# EAGLE design mssaPIC12 (EAGLE 9.6.2)
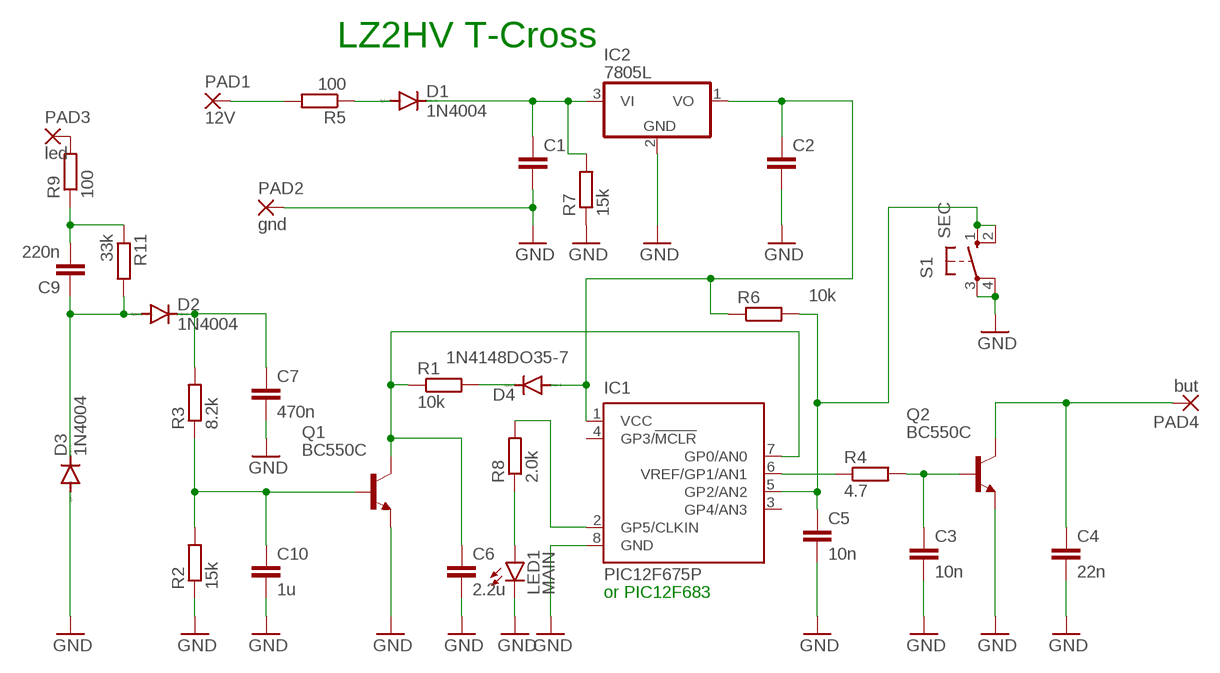
[diagram p0: schematic, sheet 1]

## Parts
C1  100n  C5/2.5  [C5B2.5]
C2  101n  C5/2.5  [C5B2.5]
C3  10n  C5/2.5  [C5B2.5]
C4  22n  C5/2.5  [C5B2.5]
C5  10n  C5/2.5  [C5B2.5]
C6  2.2u  C5/2.5  [C5B2.5]
C7  470n  C5/2.5  [C5B2.5]
C9  220n  C5/2.5  [C5B2.5]
C10  1u  C5/2.5  [C5B2.5]
D1  1N4004  [DO41-10]
D2  1N4004  [DO41-10]
D3  1N4004  [DO41-10]
D4  1N4148DO35-7  [DO35-7]
IC1  PIC12F675P  [DIL8]
IC2  7805L  [TO92]
LED1  MAIN  LED3MM  [LED3MM]
PAD1  12V  2,54/1,0  [2,54/1,0]
PAD2  gnd  2,54/1,0  [2,54/1,0]
PAD3  led  2,54/1,0  [2,54/1,0]
PAD4  but  2,54/1,0  [2,54/1,0]
Q1  BC550C  [TO92-EBC]
Q2  BC550C  [TO92-EBC]
R1  10k  R-EU_0207/7  [0207/7]
R2  15k  R-EU_0207/7  [0207/7]
R3  8.2k  R-EU_0207/7  [0207/7]
R4  4.7  R-EU_0207/7  [0207/7]
R5  100  R-EU_0207/7  [0207/7]
R6  10k  R-EU_0207/7  [0207/7]
R7  15k  R-EU_0207/7  [0207/7]
R8  2.0k  R-EU_0207/7  [0207/7]
R9  100  R-EU_0207/2V  [0207/2V]
R11  33k  R-EU_0207/2V  [0207/2V]
S1  SEC  10-XX  [B3F-10XX]

## Nets
GND: C1.2 C2.2 C3.2 C4.2 C5.2 C6.2 C7.2 C10.2 D3.A IC1.8(GND) IC2.2(GND) LED1.K(C) PAD2.1(P) Q1.E Q2.E R2.1 R7.1 S1.3(P) S1.4(P1)
N$1: C1.1 D1.C IC2.3(VI) R7.2
N$2: C2.1 D4.A IC1.1(VCC) IC2.1(VO) R6.1
N$3: C10.1 Q1.B R2.2 R3.1
N$4: C7.1 D2.C R3.2
N$5: PAD1.1(P) R5.2
N$6: IC1.6(VREF/GP1/AN1) R4.1
N$7: C3.1 Q2.B R4.2
N$8: C4.1 PAD4.1(P) Q2.C
N$9: C9.2 R9.1 R11.1
N$10: D1.A R5.1
N$11: D4.C R1.2
N$12: C5.1 IC1.5(GP2/AN2) R6.2 S1.1(S) S1.2(S1)
N$13: C9.1 D2.A D3.C R11.2
N$14: IC1.2(GP5/CLKIN) R8.2
N$15: LED1.A R8.1
N$16: PAD3.1(P) R9.2
N$17: C6.1 IC1.7(GP0/AN0) Q1.C R1.1
Unconnected: IC1.3(GP4/AN3) IC1.4(GP3/!MCLR)

## Notes on the sheet
- LZ2HV T-Cross
- or PIC12F683

## Library data of the parts
C1-C7 C9 C10 = capacitor-wima:C: CAPACITOR naming: grid - package width
D1-D3 = diode:1N4004: DIODE general purpose rectifier, 1 A
D4 = diode:1N4148: DIODE high speed (Philips)
IC1 = microchip:PIC12F675: 8-Pin FLASH-Based 8-Bit CMOS Microcontroller Precision Internal 4 MHz oscillator factory calibrated to ±1% Low Power Features: Standby Current: - 1 nA @ 2.0V, typical Operating Current: - 8.5µA @ 32 kHz, 2.0V, typical - 100µA @ 1 MHz, 2.0V, typical Watchdog Timer Current: - 300 nA @ 2.0V, typical Timer1 oscillator current: - 4µA @ 32 kHz, 2.0V, typical Analog-to-Digital Converter module: - 10-bit resolution - Programmable 4-channel input - Voltage reference input Source: http://www.microchip.com .. 41190E.pdf; MF: MICROCHIP; MPN: PIC12F675-E/P; OC_FARNELL: 9759018; OC_NEWARK: 92C4340
IC2 = linear:78*: Positive VOLTAGE REGULATOR Source: http://cache.national.com/ds/LM/LM78L05.pdf http://www.fairchildsemi.com/ds/LM/LM7805.pdf
LED1 = led:LED: LED OSRAM: - CHIPLED LG R971, LG N971, LY N971, LG Q971, LY Q971, LO R971, LY R971 LH N974, LH R974 LS Q976, LO Q976, LY Q976 LO Q996 - Hyper CHIPLED LW Q18S LB Q993, LB Q99A, LB R99A - SideLED LS A670, LO A670, LY A670, LG A670, LP A670 LB A673, LV A673, LT A673, LW A673 LH A674 LY A675 LS A676, LA A676, LO A676, LY A676, LW A676 LS A679, LY A679, LG A679 - Hyper Micro SIDELED® LS Y876, LA Y876, LO Y876, LY Y876 LT Y87S - SmartLED LW L88C, LW L88S LB L89C, LB L89S, LG L890 LS L89K, LO L89K, LY L89K LS L896, LA L896, LO L896, LY L896 - TOPLED LS T670, LO T670, LY T670, LG T670, LP T670 LSG T670, LSP T670, LSY T670, LOP T670, LYG T670 LG T671, LOG T671, LSG T671 LB T673, LV T673, LT T673, LW T673 LH T674 LS T676, LA T676, LO T676, LY T676, LB T676, LH T676, LSB T676, LW T676 LB T67C, LV T67C, LT T67C, LS T67K, LO T67K, LY T67K, LW E67C LS E67B, LA E67B, LO E67B, LY E67B, LB E67C, LV E67C, LT E67C LW T67C LS T679, LY T679, LG T679 LS T770, LO T770, LY T770, LG T770, LP T770 LB T773, LV T773, LT T773, LW T773 LH T774 LS E675, LA E675, LY E675, LS T675 LS T776, LA T776, LO T776, LY T776, LB T776 LHGB T686 LT T68C, LB T68C - Hyper Mini TOPLED® LB M676 - Mini TOPLED Santana® LG M470 LS M47K, LO M47K, LY M47K Source: http://www.osram.convergy.de LUXEON: - LUMILED® LXK2-PW12-R00, LXK2-PW12-S00, LXK2-PW14-U00, LXK2-PW14-V00 LXK2-PM12-R00, LXK2-PM12-S00, LXK2-PM14-U00 LXK2-PE12-Q00, LXK2-PE12-R00, LXK2-PE12-S00, LXK2-PE14-T00, LXK2-PE14-U00 LXK2-PB12-K00, LXK2-PB12-L00, LXK2-PB12-M00, LXK2-PB14-N00, LXK2-PB14-P00, LXK2-PB14-Q00 LXK2-PR12-L00, LXK2-PR12-M00, LXK2-PR14-Q00, LXK2-PR14-R00 LXK2-PD12-Q00, LXK2-PD12-R00, LXK2-PD12-S00 LXK2-PH12-R00, LXK2-PH12-S00 LXK2-PL12-P00, LXK2-PL12-Q00, LXK2-PL12-R00 Source: www.luxeon.com KINGBRIGHT: KA-3528ASYC Source: www.kingbright.com
PAD1-PAD4 = wirepad:2,54/1,0: THROUGH-HOLE PAD
Q1 Q2 = transistor-npn:BC550*: NPN Transistor
R1-R9 R11 = rcl:R-EU_: RESISTOR, European symbol; SPICEPREFIX: R
S1 = switch-omron:10-XX: OMRON SWITCH; MPN: B3F-1000; OC_FARNELL: 176432; OC_NEWARK: 36M3542

## Board
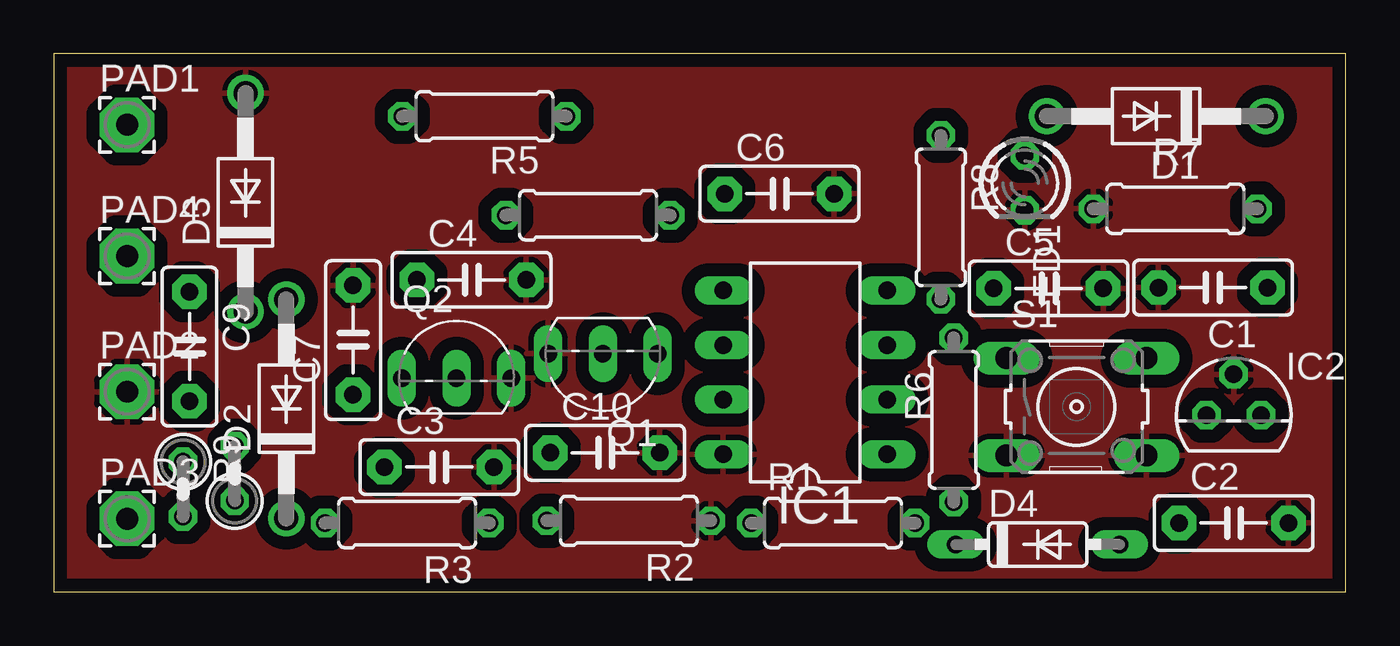
[diagram p1: board, top side]
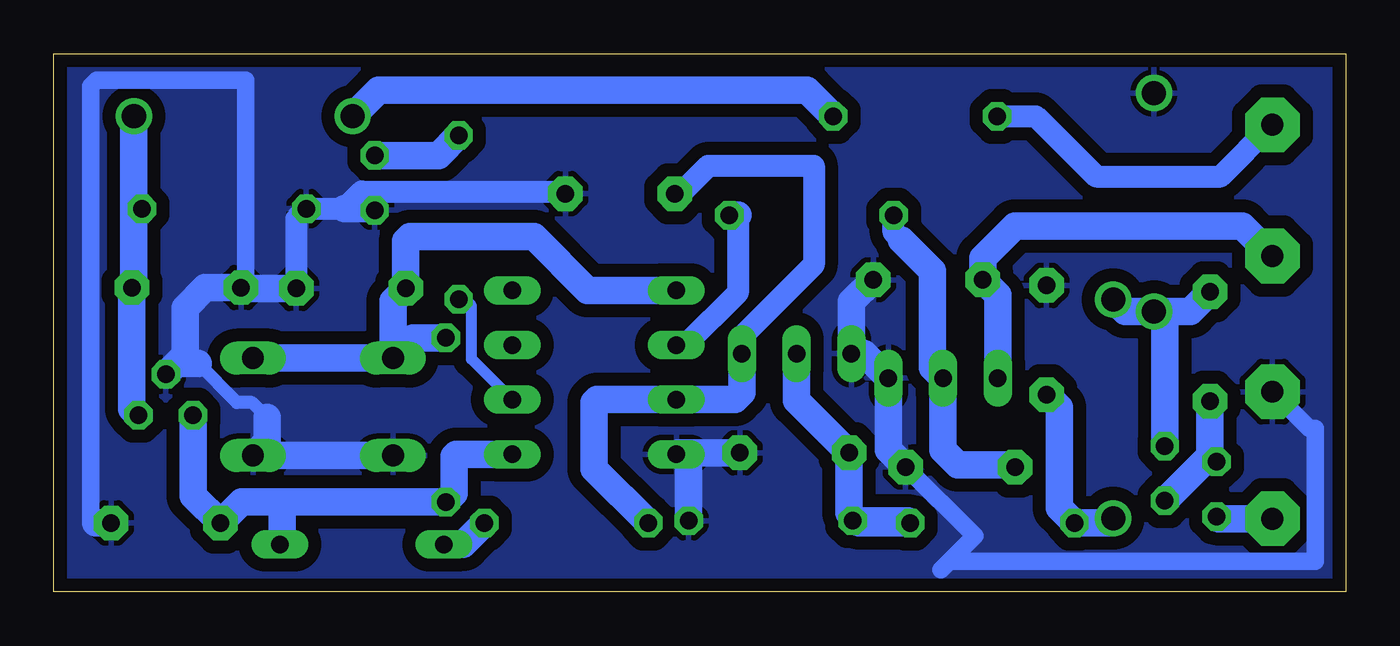
[diagram p2: board, bottom side, seen from below]

Size 60 x 25 mm. Coordinates in mm from the lower left corner, seen from the top.
Outline: 0,0 60,0 60,25 0,25 0,0
Copper layers (1*16): Top 0.035mm / dielectric 1.5mm / Bottom 0.035mm
Design rules "default *": minimum track width 10mil, minimum drill 24mil, track to track 8mil, track to pad 8mil, pad to pad 8mil, via to via 8mil, smd to smd 8mil, copper to edge 10mil, drill to drill 6mil, minimum pad ring 10mil, minimum via ring 8mil, stop-mask expansion 4mil, vias tented up to drill 0mil, thermal gap 10mil

### Footprints (pad centres in the part's own frame; a part is rotated, then mirrored left to right if it is on the bottom)
C5B2.5 = drill 0.813 pad 1.6 octagon: 1 -2.54,0; 2 2.54,0
DO41-10 = drill 1.118: A 5.08,0; C -5.08,0
DO35-7 = drill 0.813 long: A 3.81,0; C -3.81,0
DIL8 = drill 0.813 long: 1 -3.81,-3.81; 2 -1.27,-3.81; 3 1.27,-3.81; 4 3.81,-3.81; 5 3.81,3.81; 6 1.27,3.81; 7 -1.27,3.81; 8 -3.81,3.81
TO92 = drill 0.813 octagon: 1 -1.27,0; 2 0,1.905; 3 1.27,0
LED3MM = drill 0.813 octagon: A -1.27,0; K 1.27,0
2,54/1,0 = drill 1.016 pad 2.54 octagon: 1 0,0
TO92-EBC = drill 0.813 long: B 0,-1.27; C -2.54,-1.27; E 2.54,-1.27
0207/7 = drill 0.813 octagon: 1 -3.81,0; 2 3.81,0
0207/2V = drill 0.813 octagon: 1 -1.27,0; 2 1.27,0
B3F-10XX = drill 1.016 long: 1 -3.251,2.261; 2 3.251,2.261; 3 -3.251,-2.261; 4 3.251,-2.261

### Placement (x,y rotation side)
C1  53.84,14.14 180 top
C2  54.8,3.2 0 top
C3  17.9,5.8 0 top
C4  19.4,14.5 0 top
C5  46.2,14.1 0 top
C6  33.7,18.5 0 top
C7  13.9,11.7 90 top
C9  6.3,11.4 270 top
C10  25.6,6.46 0 top
D1  51.2,22.1 180 top
D2  10.8,8.5 90 top
D3  8.9,18.1 90 top
D4  45.7,2.2 0 top
IC1  34.9,10.2 90 top
IC2  54.8,8.2 0 top
LED1  45.1,19 270 top
PAD1  3.4,21.7 0 top
PAD2  3.4,9.3 0 top
PAD3  3.4,3.4 0 top
PAD4  3.4,15.6 0 top
Q1  25.5,9.8 180 top
Q2  18.7,11.2 0 top
R1  36.19,3.2 0 top
R2  26.71,3.3 180 top
R3  16.41,3.2 180 top
R4  24.81,17.5 180 top
R5  20,22.1 180 top
R6  41.8,7.99 90 top
R7  52.09,17.8 0 top
R8  41.2,17.4 270 top
R9  6,4.77 270 top
R11  8.4,5.5 90 top
S1  47.5,8.6 0 top

### Tracks (layer width: path | path; a pad name or v marks a point on that pad's centre or on a via)
GND
  Bottom 0.61: 50.1,8.1 50.8,8.8 51.5,8.8 53.3,10.6
  Bottom 0.813: C1.2 51.1,14.34 51.1,23.78 58,23.78 58.28,23.5 58.28,3.2 58.05,3.2 | 18.4,1.42 1.42,1.42 1.42,7.6 1.7,7.6 PAD2.1 | C3.2 17.23,2.59 18.4,1.42 | 18.4,1.42 18.8,1.02
  Bottom 1.016: C6.2 36.34,18.6 45.7,18.6 46.5,17.8 R7.1 48.74,17.34 C5.2
  Bottom 1.27: C10.2 31.02,6.46 | 31.02,6.46 IC1.8 | C3.2 21.24,6.6 Q2.E 22.38,11.07 Q1.E 22.96,13.48 C4.2 | 58.05,3.2 C2.2 | C5.2 51.26,14.1 C1.2 52.96,14.14 53.9,13.2 53.9,11.01 IC2.2 54.3,10.6 53.3,10.6 | S1.3 S1.4 50.1,6.99 50.1,8.1 | R2.1 30.52,5.96 31.02,6.46 | LED1.K 45.17,17.8 46.5,17.8
  pour Bottom (isolate 0.61): 0,25 60.1,25 60.1,0 0,0
  pour Top (isolate 0.61): 0,25 59.8,25 59.9,25.1 59.9,0.1 60,0 0,0
N$1
  Bottom 1.016: R7.2 56.28,18.18 56.28,18.2
  Bottom 1.27: IC2.3 56.38,8.51 C1.1 56.28,14.24 56.28,18.2 D1.C
N$2
  Bottom 1.27: IC2.1 53.53,4.47 C2.1 51.28,4.18 49.4,4.18 | IC1.1 41.31,6.39 41.4,6.3 41.4,4.58 R6.1 49.4,4.18 | D4.A 49.4,2.31 49.4,4.18
N$3
  Bottom 1.27: Q1.B 25.5,8.9 C10.1 23.06,3.66 22.6,3.2 R3.1 20.32,3.3 R2.2
N$4
  Bottom 1.27: C7.1 13.3,8.56 13.3,3.9 R3.2 11.02,3.2 D2.C
N$5
  Bottom 1.016: R5.2 14.39,22.1 11.59,19.3 5.8,19.3 PAD1.1
N$6
  Bottom 1.016: 28.23,17.5 28.23,13.89 30.65,11.47
  Bottom 1.27: R4.1 28.23,17.5 | 30.65,11.47 IC1.6
N$7
  Bottom 1.016: 20.64,16.34 21,16.7 R4.2
  Bottom 1.27: C3.1 15.46,5.9 18,5.9 18.7,6.6 Q2.B 19.2,10.43 19.2,14.9 20.64,16.34
N$8
  Bottom 1.27: PAD4.1 4.8,17 15.36,17 16.86,15.5 C4.1 16.16,13.8 Q2.C
N$9
  Bottom 1.27: C9.2 6.3,6.34 R9.1 6.59,6.04 R11.1
N$10
  Bottom 1.27: D1.A 44.92,23.3 25.01,23.3 R5.1
N$11
  Bottom 1.27: D4.C 41,2.2 R1.2
N$12
  Bottom 1.27: IC1.5 35.21,14.01 37.7,16.5 43.46,16.5 43.66,16.3 C5.1 44.25,13.51 S1.1 | S1.2 S1.1 | R6.2 43.31,11.8 S1.1
N$13
  Bottom 1.27: D2.A 10.24,13.02 D3.C | C9.1 7.22,13.02 D3.C | R11.2 8.4,12.52 D3.C
N$14
  Bottom 0.508: IC1.2 40.6,10.82 40.6,13.3 40.89,13.59 R8.2
N$15
  Bottom 1.27: LED1.A 42.14,20.27 R8.1
N$16
  Bottom 1.27: R9.2 5.9,3.4 PAD3.1
N$17
  Bottom 1.016: C6.1 30.9,18.5 29.6,19.8 24.7,19.8 24.7,15.2 28.04,11.86 Q1.C
  Bottom 1.27: Q1.C 28.04,9.26 28.37,8.93 IC1.7 34.77,8.93 34.9,8.8 34.9,5.72 R1.1